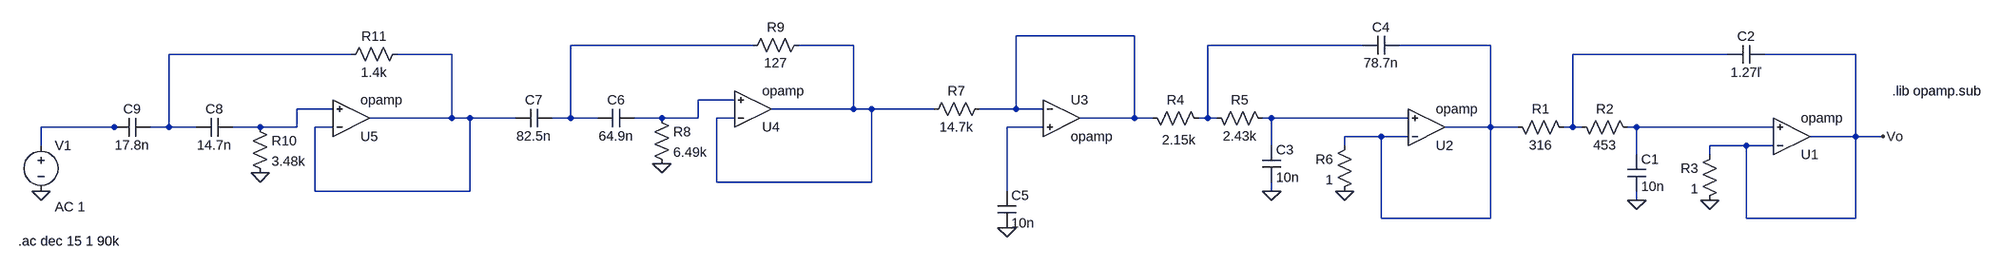
[diagram p0: schematic band_pass_filter.asc]
band_pass_filter.asc, the LTspice schematic file:
Version 4.1
SHEET 1 1532 680
WIRE 32 -48 -176 -48
WIRE -672 -32 -992 -32
WIRE -496 -32 -592 -32
WIRE 432 -32 160 -32
WIRE 656 -32 496 -32
WIRE -1376 -16 -1696 -16
WIRE -1200 -16 -1296 -16
WIRE 1072 -16 800 -16
WIRE 1296 -16 1136 -16
WIRE -704 64 -768 64
WIRE -1408 80 -1472 80
WIRE -496 80 -496 -32
WIRE -496 80 -640 80
WIRE -464 80 -496 80
WIRE -320 80 -464 80
WIRE -176 80 -176 -48
WIRE -176 80 -240 80
WIRE -128 80 -176 80
WIRE -1200 96 -1200 -16
WIRE -1200 96 -1344 96
WIRE -1168 96 -1200 96
WIRE -1088 96 -1168 96
WIRE -992 96 -992 -32
WIRE -992 96 -1024 96
WIRE -944 96 -992 96
WIRE -832 96 -880 96
WIRE -768 96 -768 64
WIRE -768 96 -832 96
WIRE -704 96 -736 96
WIRE 32 96 32 -48
WIRE 32 96 -64 96
WIRE 64 96 32 96
WIRE 160 96 160 -32
WIRE 160 96 144 96
WIRE 176 96 160 96
WIRE 272 96 256 96
WIRE 512 96 272 96
WIRE -1792 112 -1920 112
WIRE -1776 112 -1792 112
WIRE -1696 112 -1696 -16
WIRE -1696 112 -1728 112
WIRE -1648 112 -1696 112
WIRE -1536 112 -1584 112
WIRE -1472 112 -1472 80
WIRE -1472 112 -1536 112
WIRE -1408 112 -1440 112
WIRE -128 112 -192 112
WIRE 656 112 656 -32
WIRE 656 112 576 112
WIRE 704 112 656 112
WIRE 800 112 800 -16
WIRE 800 112 784 112
WIRE 816 112 800 112
WIRE 912 112 896 112
WIRE 1152 112 912 112
WIRE 464 128 400 128
WIRE 512 128 464 128
WIRE 1296 128 1296 -16
WIRE 1296 128 1216 128
WIRE 1344 128 1296 128
WIRE -1920 144 -1920 112
WIRE 272 144 272 96
WIRE 400 144 400 128
WIRE 1104 144 1040 144
WIRE 1152 144 1104 144
WIRE 912 160 912 112
WIRE 1040 160 1040 144
WIRE -736 208 -736 96
WIRE -464 208 -464 80
WIRE -464 208 -736 208
WIRE -1440 224 -1440 112
WIRE -1168 224 -1168 96
WIRE -1168 224 -1440 224
WIRE -192 224 -192 112
WIRE 272 224 272 208
WIRE 912 240 912 224
WIRE 464 272 464 128
WIRE 656 272 656 112
WIRE 656 272 464 272
WIRE 1104 272 1104 144
WIRE 1296 272 1296 128
WIRE 1296 272 1104 272
FLAG 912 240 0
FLAG 1040 240 0
FLAG 272 224 0
FLAG 400 224 0
FLAG -1920 224 0
FLAG 1344 128 Vo
FLAG -192 288 0
FLAG -1536 192 0
FLAG -832 176 0
SYMBOL res 800 128 M270
WINDOW 0 32 56 VTop 2
WINDOW 3 0 56 VBottom 2
SYMATTR InstName R1
SYMATTR Value 316
SYMBOL res 912 128 M270
WINDOW 0 32 56 VTop 2
WINDOW 3 0 56 VBottom 2
SYMATTR InstName R2
SYMATTR Value 453
SYMBOL res 1056 144 M0
SYMATTR InstName R3
SYMATTR Value 1
SYMBOL cap 896 224 M180
WINDOW 0 24 56 Left 2
WINDOW 3 24 8 Left 2
SYMATTR InstName C1
SYMATTR Value 10n
SYMBOL cap 1136 0 M270
WINDOW 0 32 32 VTop 2
WINDOW 3 0 32 VBottom 2
SYMATTR InstName C2
SYMATTR Value 1.27ľ
SYMBOL res 160 112 M270
WINDOW 0 32 56 VTop 2
WINDOW 3 -7 50 VBottom 2
SYMATTR InstName R4
SYMATTR Value 2.15k
SYMBOL res 272 112 M270
WINDOW 0 32 56 VTop 2
WINDOW 3 0 56 VBottom 2
SYMATTR InstName R5
SYMATTR Value 2.43k
SYMBOL res 416 128 M0
SYMATTR InstName R6
SYMATTR Value 1
SYMBOL cap 256 208 M180
WINDOW 0 24 56 Left 2
WINDOW 3 24 8 Left 2
SYMATTR InstName C3
SYMATTR Value 10n
SYMBOL cap 496 -16 M270
WINDOW 0 32 32 VTop 2
WINDOW 3 0 32 VBottom 2
SYMATTR InstName C4
SYMATTR Value 78.7n
SYMBOL OpAmps\\opamp 1184 192 M180
SYMATTR InstName U1
SYMBOL OpAmps\\opamp 544 176 M180
SYMATTR InstName U2
SYMBOL voltage -1920 128 R0
WINDOW 123 24 124 Left 2
WINDOW 39 0 0 Left 0
SYMATTR Value2 AC 1
SYMATTR InstName V1
SYMATTR Value ""
SYMBOL OpAmps\\opamp -96 32 R0
SYMATTR InstName U3
SYMBOL res -224 64 R90
WINDOW 0 0 56 VBottom 2
WINDOW 3 32 56 VTop 2
SYMATTR InstName R7
SYMATTR Value 14.7k
SYMBOL cap -208 224 R0
SYMATTR InstName C5
SYMATTR Value 10n
SYMBOL OpAmps\\opamp -672 144 M180
SYMATTR InstName U4
SYMBOL res -848 80 R0
SYMATTR InstName R8
SYMATTR Value 6.49k
SYMBOL res -576 -48 R90
WINDOW 0 0 56 VBottom 2
WINDOW 3 32 56 VTop 2
SYMATTR InstName R9
SYMATTR Value 127
SYMBOL cap -880 80 R90
WINDOW 0 0 32 VBottom 2
WINDOW 3 32 32 VTop 2
SYMATTR InstName C6
SYMATTR Value 64.9n
SYMBOL cap -1024 80 R90
WINDOW 0 0 32 VBottom 2
WINDOW 3 32 32 VTop 2
SYMATTR InstName C7
SYMATTR Value 82.5n
SYMBOL OpAmps\\opamp -1376 160 M180
SYMATTR InstName U5
SYMBOL res -1552 96 R0
SYMATTR InstName R10
SYMATTR Value 3.48k
SYMBOL res -1280 -32 R90
WINDOW 0 0 56 VBottom 2
WINDOW 3 32 56 VTop 2
SYMATTR InstName R11
SYMATTR Value 1.4k
SYMBOL cap -1584 96 R90
WINDOW 0 0 32 VBottom 2
WINDOW 3 32 32 VTop 2
SYMATTR InstName C8
SYMATTR Value 14.7n
SYMBOL cap -1728 96 R90
WINDOW 0 0 32 VBottom 2
WINDOW 3 32 32 VTop 2
SYMATTR InstName C9
SYMATTR Value 17.8n
TEXT 1360 48 Left 2 !.lib opamp.sub
TEXT -1960 312 Left 2 !.ac dec 15 1 90k

The netlist it stands for:
* band_pass_filter.asc
R1 N008 N005 316
R2 N014 N008 453
R3 Vo 0 1
C1 0 N014 10n
C2 Vo N008 1.27ľ
R4 N004 N001 2.15k
R5 N011 N004 2.43k
R6 N005 0 1
C3 0 N011 10n
C4 N005 N004 78.7n
X§U1 Vo N014 Vo opamp Aol=100K GBW=10Meg  ; pins invin noninvin out
X§U2 N005 N011 N005 opamp Aol=100K GBW=10Meg  ; pins invin noninvin out
V1 N012 0 AC 1
X§U3 N001 N013 N001 opamp Aol=100K GBW=10Meg  ; pins invin noninvin out
R7 N001 N003 14.7k
C5 N013 0 10n
X§U4 N003 N009 N003 opamp Aol=100K GBW=10Meg  ; pins invin noninvin out
R8 N009 0 6.49k
R9 N003 N002 127
C6 N009 N002 64.9n
C7 N002 N007 82.5n
X§U5 N007 N010 N007 opamp Aol=100K GBW=10Meg  ; pins invin noninvin out
R10 N010 0 3.48k
R11 N007 N006 1.4k
C8 N010 N006 14.7n
C9 N006 N012 17.8n
.lib opamp.sub
.ac dec 15 1 90k
.backanno
.end